# EAGLE schematic Transfer_Register (EAGLE 9.6.2)
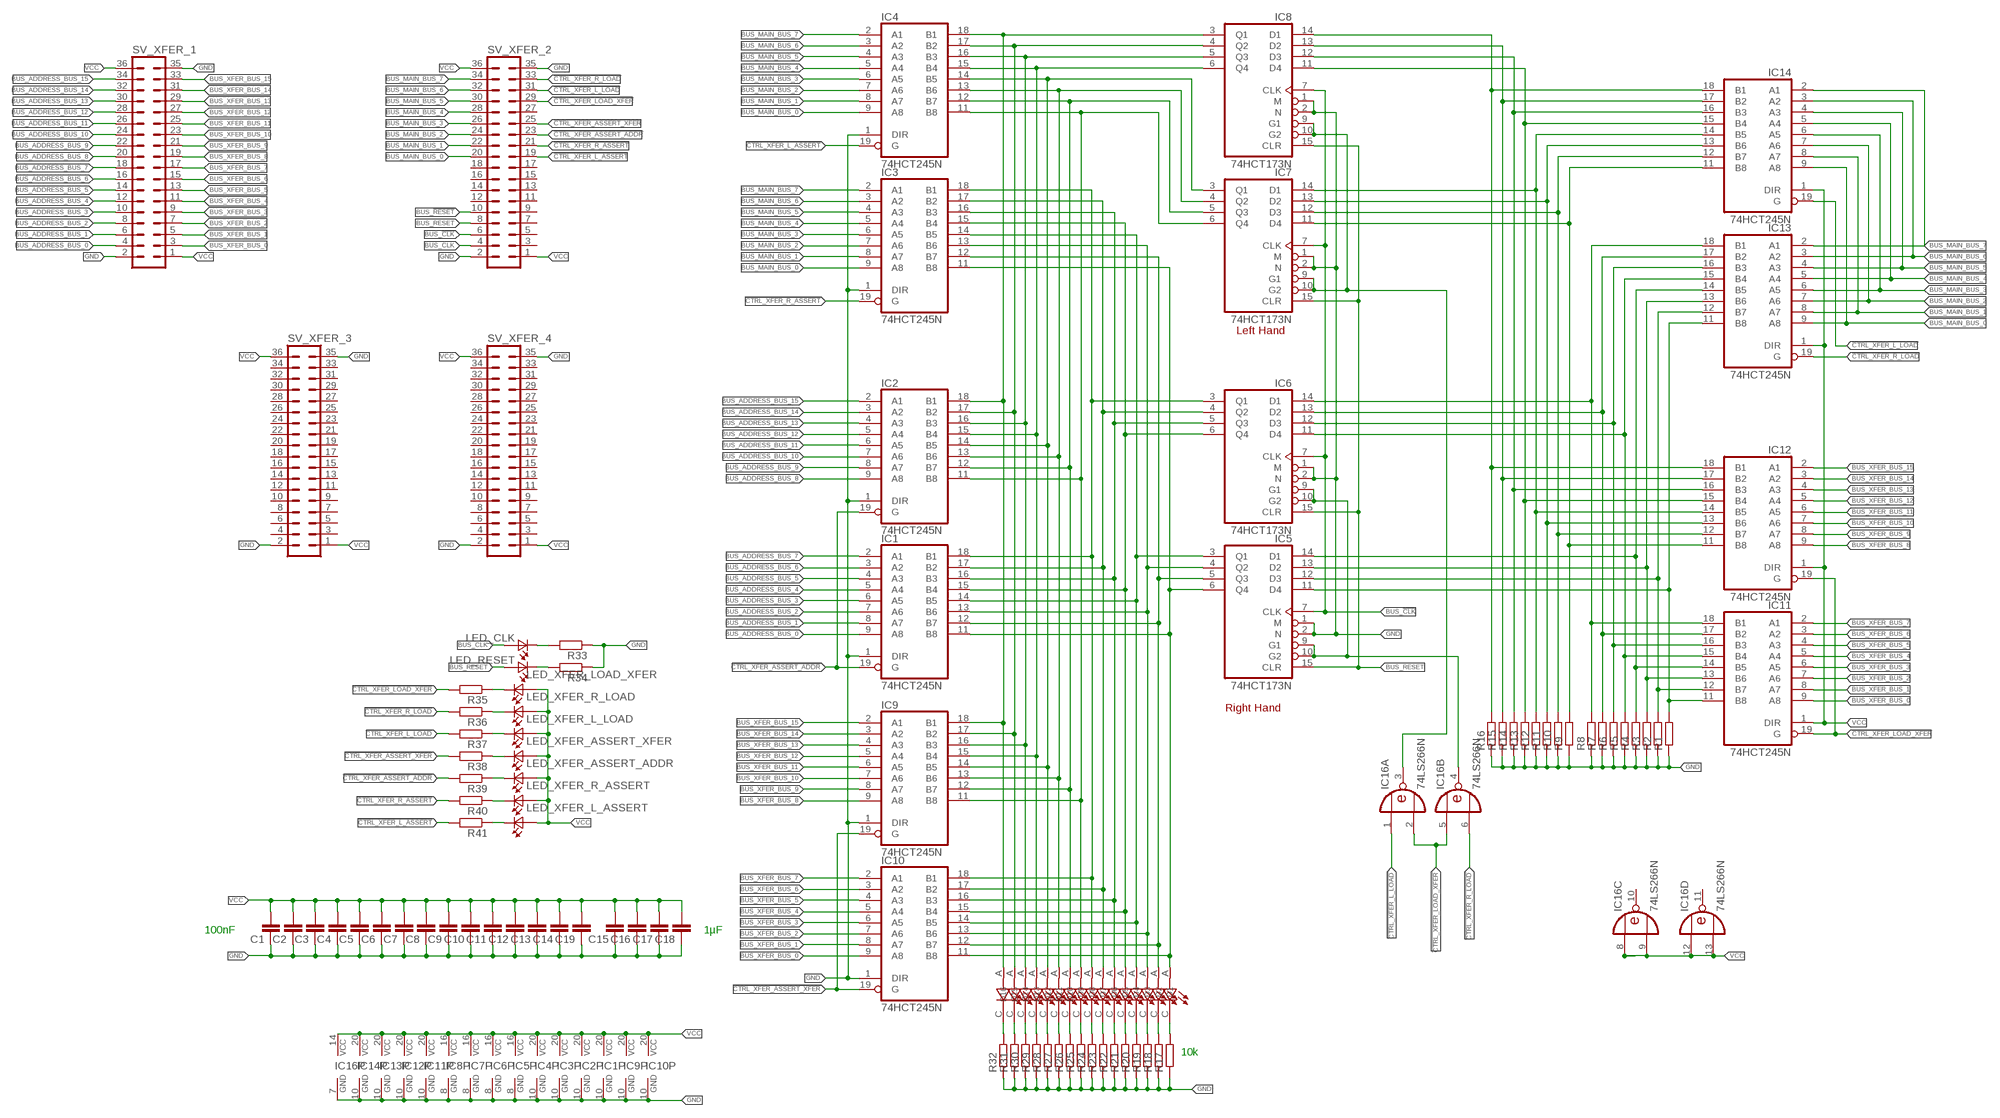
[diagram p0: schematic, sheet 1]

## Parts
C1  C-EUC0805  [C0805]
C2  C-EUC0805  [C0805]
C3  C-EUC0805  [C0805]
C4  C-EUC0805  [C0805]
C5  C-EUC0805  [C0805]
C6  C-EUC0805  [C0805]
C7  C-EUC0805  [C0805]
C8  C-EUC0805  [C0805]
C9  C-EUC0805  [C0805]
C10  C-EUC0805  [C0805]
C11  C-EUC0805  [C0805]
C12  C-EUC0805  [C0805]
C13  C-EUC0805  [C0805]
C14  C-EUC0805  [C0805]
C15  C-EUC0805  [C0805]
C16  C-EUC0805  [C0805]
C17  C-EUC0805  [C0805]
C18  C-EUC0805  [C0805]
C19  C-EUC0805  [C0805]
D1  LTST-C193KRKT-5A  [LEDC1608X45N]
D2  LTST-C193KRKT-5A  [LEDC1608X45N]
D3  LTST-C193KRKT-5A  [LEDC1608X45N]
D4  LTST-C193KRKT-5A  [LEDC1608X45N]
D5  LTST-C193KRKT-5A  [LEDC1608X45N]
D6  LTST-C193KRKT-5A  [LEDC1608X45N]
D7  LTST-C193KRKT-5A  [LEDC1608X45N]
D8  LTST-C193KRKT-5A  [LEDC1608X45N]
D9  LTST-C193KRKT-5A  [LEDC1608X45N]
D10  LTST-C193KRKT-5A  [LEDC1608X45N]
D11  LTST-C193KRKT-5A  [LEDC1608X45N]
D12  LTST-C193KRKT-5A  [LEDC1608X45N]
D13  LTST-C193KRKT-5A  [LEDC1608X45N]
D14  LTST-C193KRKT-5A  [LEDC1608X45N]
D15  LTST-C193KRKT-5A  [LEDC1608X45N]
D16  LTST-C193KRKT-5A  [LEDC1608X45N]
IC1  74HCT245N  [DIL20]
IC2  74HCT245N  [DIL20]
IC3  74HCT245N  [DIL20]
IC4  74HCT245N  [DIL20]
IC5  74HCT173N  [DIL16]
IC6  74HCT173N  [DIL16]
IC7  74HCT173N  [DIL16]
IC8  74HCT173N  [DIL16]
IC9  74HCT245N  [DIL20]
IC10  74HCT245N  [DIL20]
IC11  74HCT245N  [DIL20]
IC12  74HCT245N  [DIL20]
IC13  74HCT245N  [DIL20]
IC14  74HCT245N  [DIL20]
IC16  74LS266N  [DIL14]
LED_CLK  LTST-C193TBKT-5A  [0603]
LED_RESET  LTST-C193TBKT-5A  [0603]
LED_XFER_ASSERT_ADDR  LTST-C193TBKT-5A  [0603]
LED_XFER_ASSERT_XFER  LTST-C193TBKT-5A  [0603]
LED_XFER_L_ASSERT  LTST-C193TBKT-5A  [0603]
LED_XFER_L_LOAD  LTST-C193TBKT-5A  [0603]
LED_XFER_LOAD_XFER  LTST-C193TBKT-5A  [0603]
LED_XFER_R_ASSERT  LTST-C193TBKT-5A  [0603]
LED_XFER_R_LOAD  LTST-C193TBKT-5A  [0603]
R1  R-EU_R0805  [R0805]
R2  R-EU_R0805  [R0805]
R3  R-EU_R0805  [R0805]
R4  R-EU_R0805  [R0805]
R5  R-EU_R0805  [R0805]
R6  R-EU_R0805  [R0805]
R7  R-EU_R0805  [R0805]
R8  R-EU_R0805  [R0805]
R9  R-EU_R0805  [R0805]
R10  R-EU_R0805  [R0805]
R11  R-EU_R0805  [R0805]
R12  R-EU_R0805  [R0805]
R13  R-EU_R0805  [R0805]
R14  R-EU_R0805  [R0805]
R15  R-EU_R0805  [R0805]
R16  R-EU_R0805  [R0805]
R17  R-EU_R0805  [R0805]
R18  R-EU_R0805  [R0805]
R19  R-EU_R0805  [R0805]
R20  R-EU_R0805  [R0805]
R21  R-EU_R0805  [R0805]
R22  R-EU_R0805  [R0805]
R23  R-EU_R0805  [R0805]
R24  R-EU_R0805  [R0805]
R25  R-EU_R0805  [R0805]
R26  R-EU_R0805  [R0805]
R27  R-EU_R0805  [R0805]
R28  R-EU_R0805  [R0805]
R29  R-EU_R0805  [R0805]
R30  R-EU_R0805  [R0805]
R31  R-EU_R0805  [R0805]
R32  R-EU_R0805  [R0805]
R33  R-EU_R0805  [R0805]
R34  R-EU_R0805  [R0805]
R35  R-EU_R0805  [R0805]
R36  R-EU_R0805  [R0805]
R37  R-EU_R0805  [R0805]
R38  R-EU_R0805  [R0805]
R39  R-EU_R0805  [R0805]
R40  R-EU_R0805  [R0805]
R41  R-EU_R0805  [R0805]
SV_XFER_1  MA18-2  [MA18-2]
SV_XFER_2  MA18-2  [MA18-2]
SV_XFER_3  MA18-2  [MA18-2]
SV_XFER_4  MA18-2  [MA18-2]

## Nets
!CTRL_XFER_ASSERT_ADDR: IC1.19(G) IC2.19(G) R39.2 SV_XFER_2.23
!CTRL_XFER_ASSERT_XFER: IC9.19(G) IC10.19(G) R38.2 SV_XFER_2.25
!CTRL_XFER_L_ASSERT: IC4.19(G) R41.2 SV_XFER_2.19
!CTRL_XFER_L_LOAD: IC14.19(G) IC16.1(A:I0) R37.2 SV_XFER_2.31
!CTRL_XFER_LOAD_XFER: IC11.19(G) IC12.19(G) IC16.2(A:I1) IC16.5(B:I0) R35.2 SV_XFER_2.29
!CTRL_XFER_R_ASSERT: IC3.19(G) R40.2 SV_XFER_2.21
!CTRL_XFER_R_LOAD: IC13.19(G) IC16.6(B:I1) R36.2 SV_XFER_2.33
BUS_!CLK: IC5.7(CLK) IC6.7(CLK) IC7.7(CLK) IC8.7(CLK) SV_XFER_2.6
BUS_!RESET: SV_XFER_2.10
BUS_ADDRESS_BUS_0: IC1.9(A8) SV_XFER_1.4
BUS_ADDRESS_BUS_1: IC1.8(A7) SV_XFER_1.6
BUS_ADDRESS_BUS_2: IC1.7(A6) SV_XFER_1.8
BUS_ADDRESS_BUS_3: IC1.6(A5) SV_XFER_1.10
BUS_ADDRESS_BUS_4: IC1.5(A4) SV_XFER_1.12
BUS_ADDRESS_BUS_5: IC1.4(A3) SV_XFER_1.14
BUS_ADDRESS_BUS_6: IC1.3(A2) SV_XFER_1.16
BUS_ADDRESS_BUS_7: IC1.2(A1) SV_XFER_1.18
BUS_ADDRESS_BUS_8: IC2.9(A8) SV_XFER_1.20
BUS_ADDRESS_BUS_9: IC2.8(A7) SV_XFER_1.22
BUS_ADDRESS_BUS_10: IC2.7(A6) SV_XFER_1.24
BUS_ADDRESS_BUS_11: IC2.6(A5) SV_XFER_1.26
BUS_ADDRESS_BUS_12: IC2.5(A4) SV_XFER_1.28
BUS_ADDRESS_BUS_13: IC2.4(A3) SV_XFER_1.30
BUS_ADDRESS_BUS_14: IC2.3(A2) SV_XFER_1.32
BUS_ADDRESS_BUS_15: IC2.2(A1) SV_XFER_1.34
BUS_CLK: LED_CLK.2(A2) SV_XFER_2.4
BUS_MAIN_BUS_0: IC3.9(A8) IC4.9(A8) IC13.9(A8) IC14.9(A8) SV_XFER_2.20
BUS_MAIN_BUS_1: IC3.8(A7) IC4.8(A7) IC13.8(A7) IC14.8(A7) SV_XFER_2.22
BUS_MAIN_BUS_2: IC3.7(A6) IC4.7(A6) IC13.7(A6) IC14.7(A6) SV_XFER_2.24
BUS_MAIN_BUS_3: IC3.6(A5) IC4.6(A5) IC13.6(A5) IC14.6(A5) SV_XFER_2.26
BUS_MAIN_BUS_4: IC3.5(A4) IC4.5(A4) IC13.5(A4) IC14.5(A4) SV_XFER_2.28
BUS_MAIN_BUS_5: IC3.4(A3) IC4.4(A3) IC13.4(A3) IC14.4(A3) SV_XFER_2.30
BUS_MAIN_BUS_6: IC3.3(A2) IC4.3(A2) IC13.3(A2) IC14.3(A2) SV_XFER_2.32
BUS_MAIN_BUS_7: IC3.2(A1) IC4.2(A1) IC13.2(A1) IC14.2(A1) SV_XFER_2.34
BUS_RESET: IC5.15(CLR) IC6.15(CLR) IC7.15(CLR) IC8.15(CLR) LED_RESET.2(A2) SV_XFER_2.8
BUS_XFER_BUS_0: IC10.9(A8) IC11.9(A8) SV_XFER_1.3
BUS_XFER_BUS_1: IC10.8(A7) IC11.8(A7) SV_XFER_1.5
BUS_XFER_BUS_2: IC10.7(A6) IC11.7(A6) SV_XFER_1.7
BUS_XFER_BUS_3: IC10.6(A5) IC11.6(A5) SV_XFER_1.9
BUS_XFER_BUS_4: IC10.5(A4) IC11.5(A4) SV_XFER_1.11
BUS_XFER_BUS_5: IC10.4(A3) IC11.4(A3) SV_XFER_1.13
BUS_XFER_BUS_6: IC10.3(A2) IC11.3(A2) SV_XFER_1.15
BUS_XFER_BUS_7: IC10.2(A1) IC11.2(A1) SV_XFER_1.17
BUS_XFER_BUS_8: IC9.9(A8) IC12.9(A8) SV_XFER_1.19
BUS_XFER_BUS_9: IC9.8(A7) IC12.8(A7) SV_XFER_1.21
BUS_XFER_BUS_10: IC9.7(A6) IC12.7(A6) SV_XFER_1.23
BUS_XFER_BUS_11: IC9.6(A5) IC12.6(A5) SV_XFER_1.25
BUS_XFER_BUS_12: IC9.5(A4) IC12.5(A4) SV_XFER_1.27
BUS_XFER_BUS_13: IC9.4(A3) IC12.4(A3) SV_XFER_1.29
BUS_XFER_BUS_14: IC9.3(A2) IC12.3(A2) SV_XFER_1.31
BUS_XFER_BUS_15: IC9.2(A1) IC12.2(A1) SV_XFER_1.33
GND: C1.1 C2.1 C3.1 C4.1 C5.1 C6.1 C7.1 C8.1 C9.1 C10.1 C11.1 C12.1 C13.1 C14.1 C15.1 C16.1 C17.1 C18.1 C19.1 IC1.1(DIR) IC1.10(GND) IC2.1(DIR) IC2.10(GND) IC3.1(DIR) IC3.10(GND) IC4.1(DIR) IC4.10(GND) IC5.1(M) IC5.2(N) IC5.8(GND) IC6.1(M) IC6.2(N) IC6.8(GND) IC7.1(M) IC7.2(N) IC7.8(GND) IC8.1(M) IC8.2(N) IC8.8(GND) IC9.1(DIR) IC9.10(GND) IC10.1(DIR) IC10.10(GND) IC11.10(GND) IC12.10(GND) IC13.10(GND) IC14.10(GND) IC16.7(P:GND) R1.1 R2.1 R3.1 R4.1 R5.1 R6.1 R7.1 R8.1 R9.1 R10.1 R11.1 R12.1 R13.1 R14.1 R15.1 R16.1 R17.1 R18.1 R19.1 R20.1 R21.1 R22.1 R23.1 R24.1 R25.1 R26.1 R27.1 R28.1 R29.1 R30.1 R31.1 R32.1 R33.1 R34.1 SV_XFER_1.2 SV_XFER_1.35 SV_XFER_2.2 SV_XFER_2.35 SV_XFER_3.2 SV_XFER_3.35 SV_XFER_4.2 SV_XFER_4.35
N$1: LED_CLK.1(K2) R33.2
N$2: LED_RESET.1(K2) R34.2
N$3: LED_XFER_LOAD_XFER.1(K2) R35.1
N$4: LED_XFER_R_LOAD.1(K2) R36.1
N$5: LED_XFER_L_LOAD.1(K2) R37.1
N$6: LED_XFER_ASSERT_XFER.1(K2) R38.1
N$7: LED_XFER_ASSERT_ADDR.1(K2) R39.1
N$8: LED_XFER_R_ASSERT.1(K2) R40.1
N$9: LED_XFER_L_ASSERT.1(K2) R41.1
N$38: D16.A IC2.18(B1) IC4.18(B1) IC8.3(Q1) IC9.18(B1)
N$39: D15.A IC2.17(B2) IC4.17(B2) IC8.4(Q2) IC9.17(B2)
N$40: D14.A IC2.16(B3) IC4.16(B3) IC8.5(Q3) IC9.16(B3)
N$41: D13.A IC2.15(B4) IC4.15(B4) IC8.6(Q4) IC9.15(B4)
N$42: D12.A IC2.14(B5) IC4.14(B5) IC7.3(Q1) IC9.14(B5)
N$43: D11.A IC2.13(B6) IC4.13(B6) IC7.4(Q2) IC9.13(B6)
N$44: D10.A IC2.12(B7) IC4.12(B7) IC7.5(Q3) IC9.12(B7)
N$45: D9.A IC2.11(B8) IC4.11(B8) IC7.6(Q4) IC9.11(B8)
N$46: D8.A IC1.18(B1) IC3.18(B1) IC6.3(Q1) IC10.18(B1)
N$47: D7.A IC1.17(B2) IC3.17(B2) IC6.4(Q2) IC10.17(B2)
N$48: D6.A IC1.16(B3) IC3.16(B3) IC6.5(Q3) IC10.16(B3)
N$49: D5.A IC1.15(B4) IC3.15(B4) IC6.6(Q4) IC10.15(B4)
N$50: D4.A IC1.14(B5) IC3.14(B5) IC5.3(Q1) IC10.14(B5)
N$51: D3.A IC1.13(B6) IC3.13(B6) IC5.4(Q2) IC10.13(B6)
N$52: D2.A IC1.12(B7) IC3.12(B7) IC5.5(Q3) IC10.12(B7)
N$53: D1.A IC1.11(B8) IC3.11(B8) IC5.6(Q4) IC10.11(B8)
N$55: IC7.11(D4) IC12.11(B8) IC14.11(B8) R9.2
N$56: IC7.12(D3) IC12.12(B7) IC14.12(B7) R10.2
N$57: IC5.9(G1) IC5.10(G2) IC6.9(G1) IC6.10(G2) IC16.4(B:O)
N$58: IC7.13(D2) IC12.13(B6) IC14.13(B6) R11.2
N$59: IC7.9(G1) IC7.10(G2) IC8.9(G1) IC8.10(G2) IC16.3(A:O)
N$60: IC7.14(D1) IC12.14(B5) IC14.14(B5) R12.2
N$61: IC8.11(D4) IC12.15(B4) IC14.15(B4) R13.2
N$64: IC5.11(D4) IC11.11(B8) IC13.11(B8) R1.2
N$65: IC5.12(D3) IC11.12(B7) IC13.12(B7) R2.2
N$66: IC5.13(D2) IC11.13(B6) IC13.13(B6) R3.2
N$67: IC5.14(D1) IC11.14(B5) IC13.14(B5) R4.2
N$68: IC6.11(D4) IC11.15(B4) IC13.15(B4) R5.2
N$69: IC6.12(D3) IC11.16(B3) IC13.16(B3) R6.2
N$70: IC6.13(D2) IC11.17(B2) IC13.17(B2) R7.2
N$71: IC6.14(D1) IC11.18(B1) IC13.18(B1) R8.2
N$72: IC8.12(D3) IC12.16(B3) IC14.16(B3) R14.2
N$73: IC8.13(D2) IC12.17(B2) IC14.17(B2) R15.2
N$74: IC8.14(D1) IC12.18(B1) IC14.18(B1) R16.2
N$105: D1.C R17.2
N$106: D2.C R18.2
N$107: D3.C R19.2
N$108: D4.C R20.2
N$109: D5.C R21.2
N$110: D6.C R22.2
N$111: D7.C R23.2
N$112: D8.C R24.2
N$113: D9.C R25.2
N$114: D10.C R26.2
N$115: D11.C R27.2
N$116: D12.C R28.2
N$117: D13.C R29.2
N$118: D14.C R30.2
N$119: D15.C R31.2
N$120: D16.C R32.2
VCC: C1.2 C2.2 C3.2 C4.2 C5.2 C6.2 C7.2 C8.2 C9.2 C10.2 C11.2 C12.2 C13.2 C14.2 C15.2 C16.2 C17.2 C18.2 C19.2 IC1.20(VCC) IC2.20(VCC) IC3.20(VCC) IC4.20(VCC) IC5.16(VCC) IC6.16(VCC) IC7.16(VCC) IC8.16(VCC) IC9.20(VCC) IC10.20(VCC) IC11.1(DIR) IC11.20(VCC) IC12.1(DIR) IC12.20(VCC) IC13.1(DIR) IC13.20(VCC) IC14.1(DIR) IC14.20(VCC) IC16.8(C:I0) IC16.9(C:I1) IC16.12(D:I0) IC16.13(D:I1) IC16.14(P:VCC) LED_XFER_ASSERT_ADDR.2(A2) LED_XFER_ASSERT_XFER.2(A2) LED_XFER_L_ASSERT.2(A2) LED_XFER_L_LOAD.2(A2) LED_XFER_LOAD_XFER.2(A2) LED_XFER_R_ASSERT.2(A2) LED_XFER_R_LOAD.2(A2) SV_XFER_1.1 SV_XFER_1.36 SV_XFER_2.1 SV_XFER_2.36 SV_XFER_3.1 SV_XFER_3.36 SV_XFER_4.1 SV_XFER_4.36
Unconnected: IC16.10(C:O) IC16.11(D:O) SV_XFER_2.3 SV_XFER_2.5 SV_XFER_2.7 SV_XFER_2.9 SV_XFER_2.11 SV_XFER_2.12 SV_XFER_2.13 SV_XFER_2.14 SV_XFER_2.15 SV_XFER_2.16 SV_XFER_2.17 SV_XFER_2.18 SV_XFER_2.27 SV_XFER_3.3 SV_XFER_3.4 SV_XFER_3.5 SV_XFER_3.6 SV_XFER_3.7 SV_XFER_3.8 SV_XFER_3.9 SV_XFER_3.10 SV_XFER_3.11 SV_XFER_3.12 SV_XFER_3.13 SV_XFER_3.14 SV_XFER_3.15 SV_XFER_3.16 SV_XFER_3.17 SV_XFER_3.18 SV_XFER_3.19 SV_XFER_3.20 SV_XFER_3.21 SV_XFER_3.22 SV_XFER_3.23 SV_XFER_3.24 SV_XFER_3.25 SV_XFER_3.26 SV_XFER_3.27 SV_XFER_3.28 SV_XFER_3.29 SV_XFER_3.30 SV_XFER_3.31 SV_XFER_3.32 SV_XFER_3.33 SV_XFER_3.34 SV_XFER_4.3 SV_XFER_4.4 SV_XFER_4.5 SV_XFER_4.6 SV_XFER_4.7 SV_XFER_4.8 SV_XFER_4.9 SV_XFER_4.10 SV_XFER_4.11 SV_XFER_4.12 SV_XFER_4.13 SV_XFER_4.14 SV_XFER_4.15 SV_XFER_4.16 SV_XFER_4.17 SV_XFER_4.18 SV_XFER_4.19 SV_XFER_4.20 SV_XFER_4.21 SV_XFER_4.22 SV_XFER_4.23 SV_XFER_4.24 SV_XFER_4.25 SV_XFER_4.26 SV_XFER_4.27 SV_XFER_4.28 SV_XFER_4.29 SV_XFER_4.30 SV_XFER_4.31 SV_XFER_4.32 SV_XFER_4.33 SV_XFER_4.34

## Notes on the sheet
- Left Hand
- Right Hand
- 100nF | 1µF
- 10k

## Library data of the parts
C1-C19 = rcl:C-EU: CAPACITOR, European symbol; SPICEPREFIX: C
D1-D16 = Dargon's_lib:LTST-C193KRKT-5A: Red 631nm LED Indication - Discrete 2V 0603 (1608 Metric); MANUFACTURER: Lite-On; MAXIMUM_PACKAGE_HEIGHT: 0.45 mm; PARTREV: C; STANDARD: IPC 7351B
IC1-IC4 IC9-IC14 = 74xx-eu:74*245: Octal BUS TRANSCEIVER, 3-state
IC5-IC8 = 74xx-eu:74*173: 4-bit D type REGISTER, 3-state
IC16 = 74xx-eu:74*266: Quadruple EXCLUSIVE-NOR (XNOR), open-collector
LED_CLK LED_RESET LED_XFER_ASSERT_ADDR LED_XFER_ASSERT_XFER LED_XFER_L_ASSERT LED_XFER_L_LOAD LED_XFER_LOAD_XFER LED_XFER_R_ASSERT LED_XFER_R_LOAD = Dargon's_lib:LTST-C193TBKT-5A: http://octopart.com/ltst-c190tbkt-lite-on-550003
R1-R41 = rcl:R-EU_: RESISTOR, European symbol; SPICEPREFIX: R
SV_XFER_1-SV_XFER_4 = con-lstb:MA18-2: PIN HEADER; OC_FARNELL: unknown; OC_NEWARK: unknown